# Altium schematic sheet Schéma bloc.SchDoc: MesureTH
size 276 x 198 mm; Date: 21.08.2024; CheckedBy: CFO; DrawnBy: MPT; Organization: ETML-ES; Address1: Av. Recordon 1bis; Address2: 1004 Lausanne; Address3: Suisse; DocumentNumber: 2409; SheetNumber: 1; SheetTotal: 5; CheckingDate: 26.08.2024
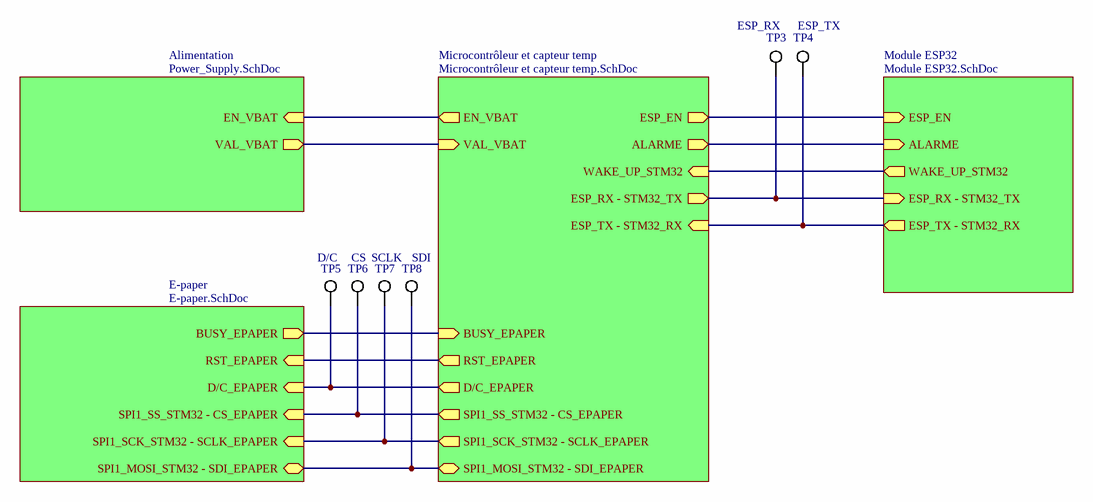
[diagram p0: Schéma bloc.SchDoc]

## Parts
TP3  Test_Point_SMD  [5019]  (value not drawn)
TP4  Test_Point_SMD  [5019]  (value not drawn)
TP5  Test_Point_SMD  [5019]  (value not drawn)
TP6  Test_Point_SMD  [5019]  (value not drawn)
TP7  Test_Point_SMD  [5019]  (value not drawn)
TP8  Test_Point_SMD  [5019]  (value not drawn)

## Sub-sheets
Alimentation = Power_Supply.SchDoc: EN_VBAT (in), VAL_VBAT (out)
E-paper = E-paper.SchDoc: BUSY_EPAPER (out), SPI1_MOSI_STM32 - SDI_EPAPER (bidir), RST_EPAPER (in), D/C_EPAPER (in), SPI1_SS_STM32 - CS_EPAPER (in), SPI1_SCK_STM32 - SCLK_EPAPER (in)
Microcontrôleur et capteur temp = Microcontrôleur et capteur temp.SchDoc: EN_VBAT (out), VAL_VBAT (in), BUSY_EPAPER (in), RST_EPAPER (out), D/C_EPAPER (out), SPI1_SS_STM32 - CS_EPAPER (out), SPI1_SCK_STM32 - SCLK_EPAPER (out), SPI1_MOSI_STM32 - SDI_EPAPER (bidir), ESP_EN (out), ALARME (out), WAKE_UP_STM32 (in), ESP_RX - STM32_TX (out), ESP_TX - STM32_RX (in)
Module ESP32 = Module ESP32.SchDoc: ESP_EN (in), ALARME (in), WAKE_UP_STM32 (out), ESP_RX - STM32_TX (in), ESP_TX - STM32_RX (out)

## Nets
NetTP3_1: TP3.1 ; sheet Microcontrôleur et capteur temp/ESP_RX - STM32_TX, sheet Module ESP32/ESP_RX - STM32_TX
NetTP4_1: TP4.1 ; sheet Microcontrôleur et capteur temp/ESP_TX - STM32_RX, sheet Module ESP32/ESP_TX - STM32_RX
NetTP5_1: TP5.1 ; sheet Microcontrôleur et capteur temp/D/C_EPAPER, sheet E-paper/D/C_EPAPER
NetTP6_1: TP6.1 ; sheet Microcontrôleur et capteur temp/SPI1_SS_STM32 - CS_EPAPER, sheet E-paper/SPI1_SS_STM32 - CS_EPAPER
NetTP7_1: TP7.1 ; sheet Microcontrôleur et capteur temp/SPI1_SCK_STM32 - SCLK_EPAPER, sheet E-paper/SPI1_SCK_STM32 - SCLK_EPAPER
NetTP8_1: TP8.1 ; sheet Microcontrôleur et capteur temp/SPI1_MOSI_STM32 - SDI_EPAPER, sheet E-paper/SPI1_MOSI_STM32 - SDI_EPAPER
(unnamed): sheet Alimentation/EN_VBAT, sheet Microcontrôleur et capteur temp/EN_VBAT
(unnamed): sheet Alimentation/VAL_VBAT, sheet Microcontrôleur et capteur temp/VAL_VBAT
(unnamed): sheet Microcontrôleur et capteur temp/BUSY_EPAPER, sheet E-paper/BUSY_EPAPER
(unnamed): sheet Microcontrôleur et capteur temp/RST_EPAPER, sheet E-paper/RST_EPAPER
(unnamed): sheet Microcontrôleur et capteur temp/ESP_EN, sheet Module ESP32/ESP_EN
(unnamed): sheet Microcontrôleur et capteur temp/ALARME, sheet Module ESP32/ALARME
(unnamed): sheet Microcontrôleur et capteur temp/WAKE_UP_STM32, sheet Module ESP32/WAKE_UP_STM32

## Notes on the sheet
- ESP_RX
- ESP_TX
- D/C
- CS
- SCLK
- SDI
- a
- Dessiné
- A4
- Echelle :
- Mod.
- b
- c
- d
- Contrôlé
- Remplace
- Nb. feuilles
- Feuille n°
- Nom du projet
- No